# EAGLE design esp8266 (EAGLE 7.1.0)
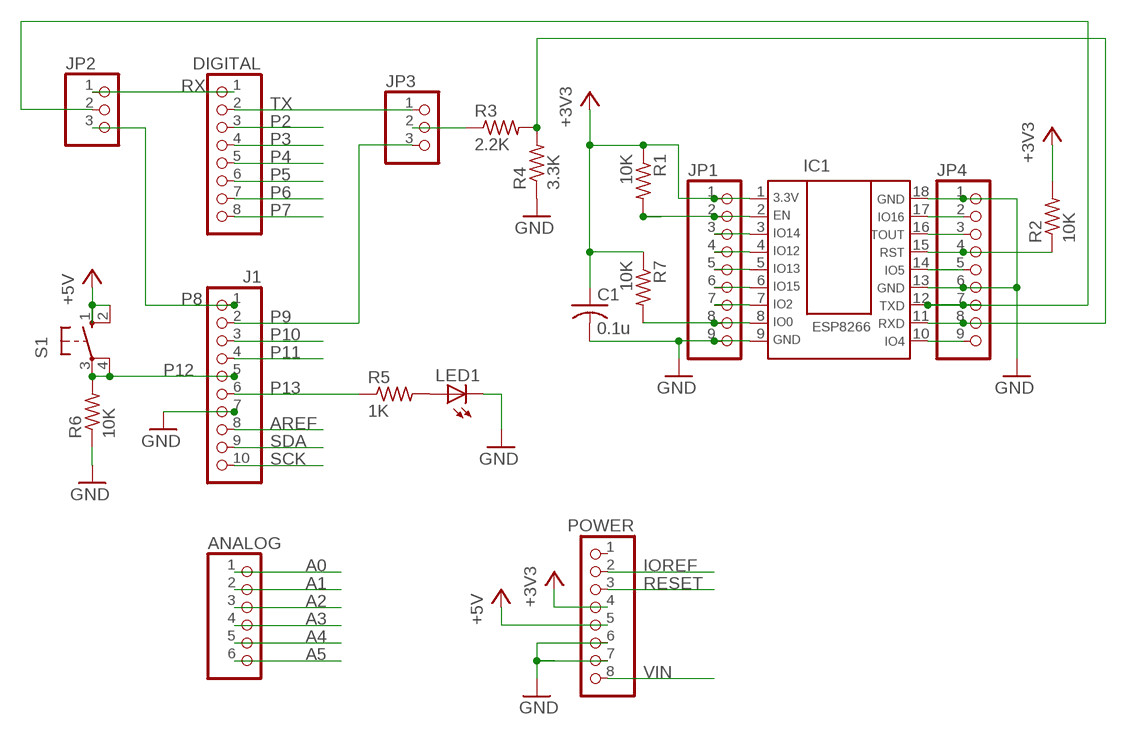
[diagram p0: schematic, sheet 1]

## Parts
ANALOG  PINHD-1X6  [1X06]
C1  0.1u  C-US050-025X075  [C050-025X075]
DIGITAL  PINHD-1X8TH  [1X08-TH]
IC1  ESP8266  [CEREVO-PKG]
J1  PINHD-1X10TH  [1X10-TH]
JP1  PINHD-1X9  [1X09]
JP2  PINHD-1X3  [1X03]
JP3  PINHD-1X3  [1X03]
JP4  PINHD-1X9  [1X09]
LED1  LED3MM  [LED3MM]
POWER  PINHD-1X8TH  [1X08-TH]
R1  10K  R-US_0207/10  [0207/10]
R2  10K  R-US_0207/10  [0207/10]
R3  2.2K  R-US_0207/10  [0207/10]
R4  3.3K  R-US_0207/10  [0207/10]
R5  1K  R-US_0207/10  [0207/10]
R6  10K  R-US_0207/10  [0207/10]
R7  10K  R-US_0207/10  [0207/10]
S1  10-XX  [B3F-10XX]

## Nets
+3V3: C1.1 IC1.1 JP1.1 POWER.4 R1.1 R2.2 R7.1
+5V: POWER.5 S1.1(S) S1.2(S1)
A0: ANALOG.1
A1: ANALOG.2
A2: ANALOG.3
A3: ANALOG.4
A4: ANALOG.5
A5: ANALOG.6
AREF: J1.8
GND: C1.2 IC1.9 IC1.13 IC1.18 J1.7 JP1.9 JP4.1 JP4.6 LED1.K(C) POWER.6 POWER.7 R4.1 R6.1
IOREF: POWER.2
N$1: IC1.11 JP4.8 R3.2 R4.2
N$2: LED1.A R5.2
N$3: JP3.2 R3.1
N$4: IC1.12 JP2.2 JP4.7
N$5: IC1.2 JP1.2 R1.2
N$6: IC1.15 JP4.4 R2.1
N$7: IC1.3 JP1.3
N$10: IC1.4 JP1.4
N$11: IC1.5 JP1.5
N$12: IC1.6 JP1.6
N$13: IC1.7 JP1.7
N$14: IC1.8 JP1.8 R7.2
N$15: IC1.10 JP4.9
N$16: IC1.17 JP4.2
N$17: IC1.16 JP4.3
N$18: IC1.14 JP4.5
P2: DIGITAL.3
P3: DIGITAL.4
P4: DIGITAL.5
P5: DIGITAL.6
P6: DIGITAL.7
P7: DIGITAL.8
P8: J1.1 JP2.3
P9: J1.2 JP3.3
P10: J1.3
P11: J1.4
P12: J1.5 R6.2 S1.3(P) S1.4(P1)
P13: J1.6 R5.1
RESET: POWER.3
RX: DIGITAL.1 JP2.1
SCK: J1.10
SDA: J1.9
TX: DIGITAL.2 JP3.1
VIN: POWER.8
Unconnected: POWER.1

## Library data of the parts
ANALOG = pinhead:PINHD-1X6: PIN HEADER
C1 = resistor:C-US: CAPACITOR, American symbol
DIGITAL POWER = SmartPrj:PINHD-1X8: PIN HEADER
IC1 = ESP8266:ESP8266: Dual In Line / Socket
J1 = SmartPrj:PINHD-1X10: PIN HEADER
JP1 JP4 = pinhead:PINHD-1X9: PIN HEADER
JP2 JP3 = pinhead:PINHD-1X3: PIN HEADER
LED1 = led:LED: LED OSRAM: - CHIPLED LG R971, LG N971, LY N971, LG Q971, LY Q971, LO R971, LY R971 LH N974, LH R974 LS Q976, LO Q976, LY Q976 LO Q996 - Hyper CHIPLED LW Q18S LB Q993, LB Q99A, LB R99A - SideLED LS A670, LO A670, LY A670, LG A670, LP A670 LB A673, LV A673, LT A673, LW A673 LH A674 LY A675 LS A676, LA A676, LO A676, LY A676, LW A676 LS A679, LY A679, LG A679 - Hyper Micro SIDELED® LS Y876, LA Y876, LO Y876, LY Y876 LT Y87S - SmartLED LW L88C, LW L88S LB L89C, LB L89S, LG L890 LS L89K, LO L89K, LY L89K LS L896, LA L896, LO L896, LY L896 - TOPLED LS T670, LO T670, LY T670, LG T670, LP T670 LSG T670, LSP T670, LSY T670, LOP T670, LYG T670 LG T671, LOG T671, LSG T671 LB T673, LV T673, LT T673, LW T673 LH T674 LS T676, LA T676, LO T676, LY T676, LB T676, LH T676, LSB T676, LW T676 LB T67C, LV T67C, LT T67C, LS T67K, LO T67K, LY T67K, LW E67C LS E67B, LA E67B, LO E67B, LY E67B, LB E67C, LV E67C, LT E67C LW T67C LS T679, LY T679, LG T679 LS T770, LO T770, LY T770, LG T770, LP T770 LB T773, LV T773, LT T773, LW T773 LH T774 LS E675, LA E675, LY E675, LS T675 LS T776, LA T776, LO T776, LY T776, LB T776 LHGB T686 LT T68C, LB T68C - Hyper Mini TOPLED® LB M676 - Mini TOPLED Santana® LG M470 LS M47K, LO M47K, LY M47K Source: http://www.osram.convergy.de LUXEON: - LUMILED® LXK2-PW12-R00, LXK2-PW12-S00, LXK2-PW14-U00, LXK2-PW14-V00 LXK2-PM12-R00, LXK2-PM12-S00, LXK2-PM14-U00 LXK2-PE12-Q00, LXK2-PE12-R00, LXK2-PE12-S00, LXK2-PE14-T00, LXK2-PE14-U00 LXK2-PB12-K00, LXK2-PB12-L00, LXK2-PB12-M00, LXK2-PB14-N00, LXK2-PB14-P00, LXK2-PB14-Q00 LXK2-PR12-L00, LXK2-PR12-M00, LXK2-PR14-Q00, LXK2-PR14-R00 LXK2-PD12-Q00, LXK2-PD12-R00, LXK2-PD12-S00 LXK2-PH12-R00, LXK2-PH12-S00 LXK2-PL12-P00, LXK2-PL12-Q00, LXK2-PL12-R00 Source: www.luxeon.com KINGBRIGHT: KA-3528ASYC Source: www.kingbright.com
R1-R7 = resistor:R-US_: RESISTOR, American symbol
S1 = switch-omron:10-XX: OMRON SWITCH; MPN: B3F-1000; OC_FARNELL: 176432; OC_NEWARK: 36M3542

## Board
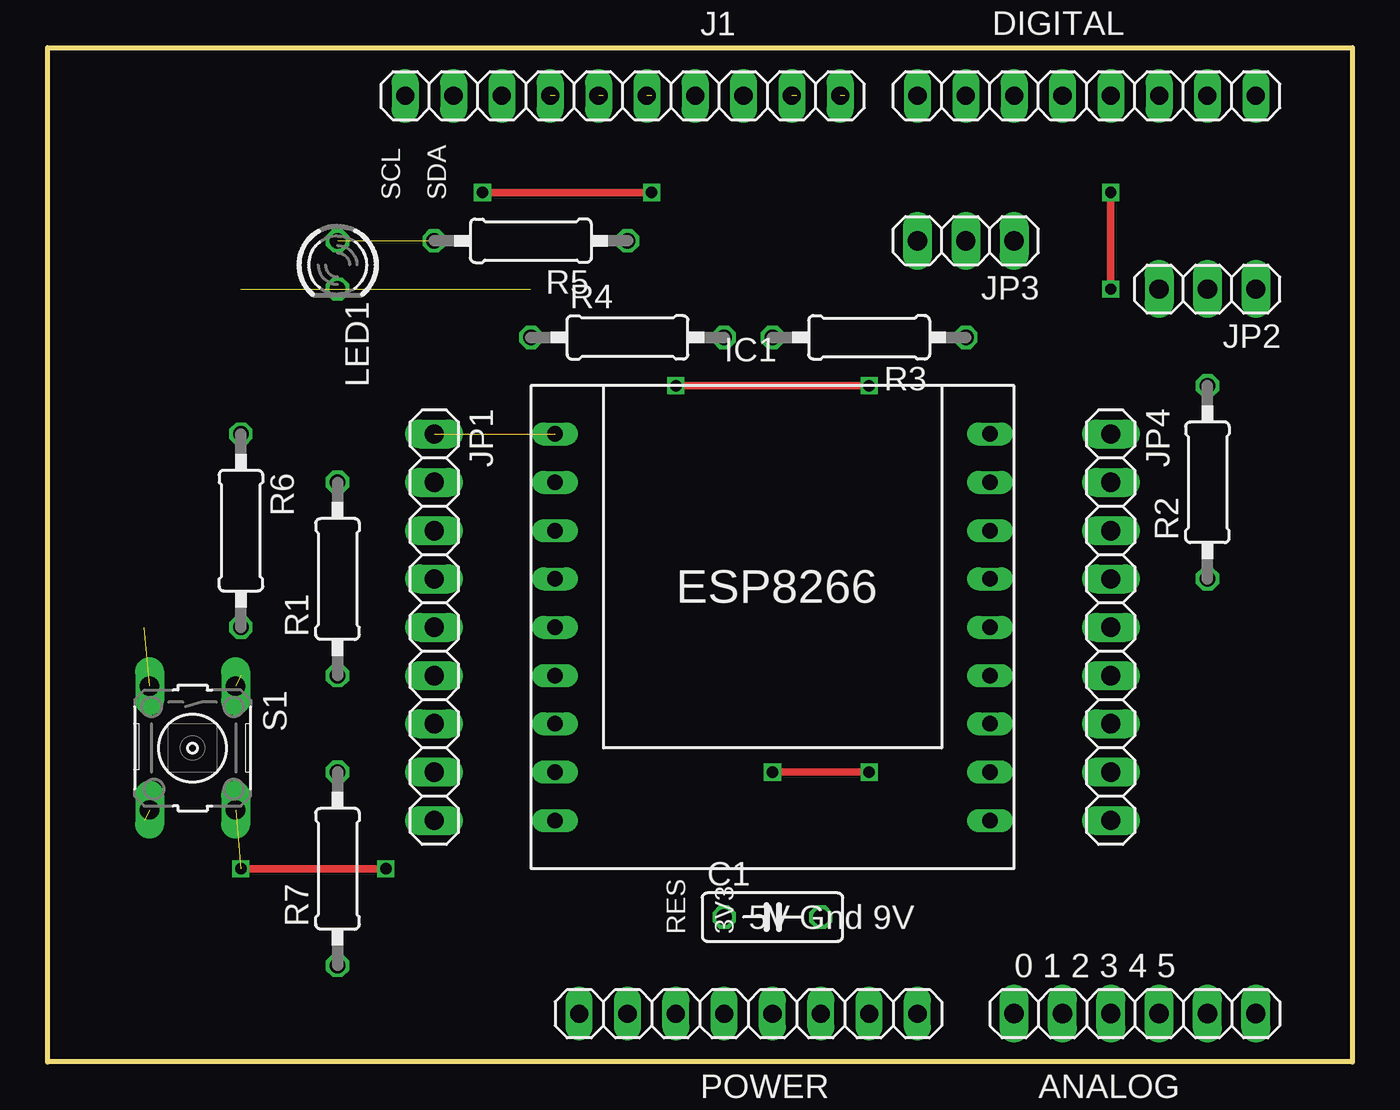
[diagram p1: board, top side]
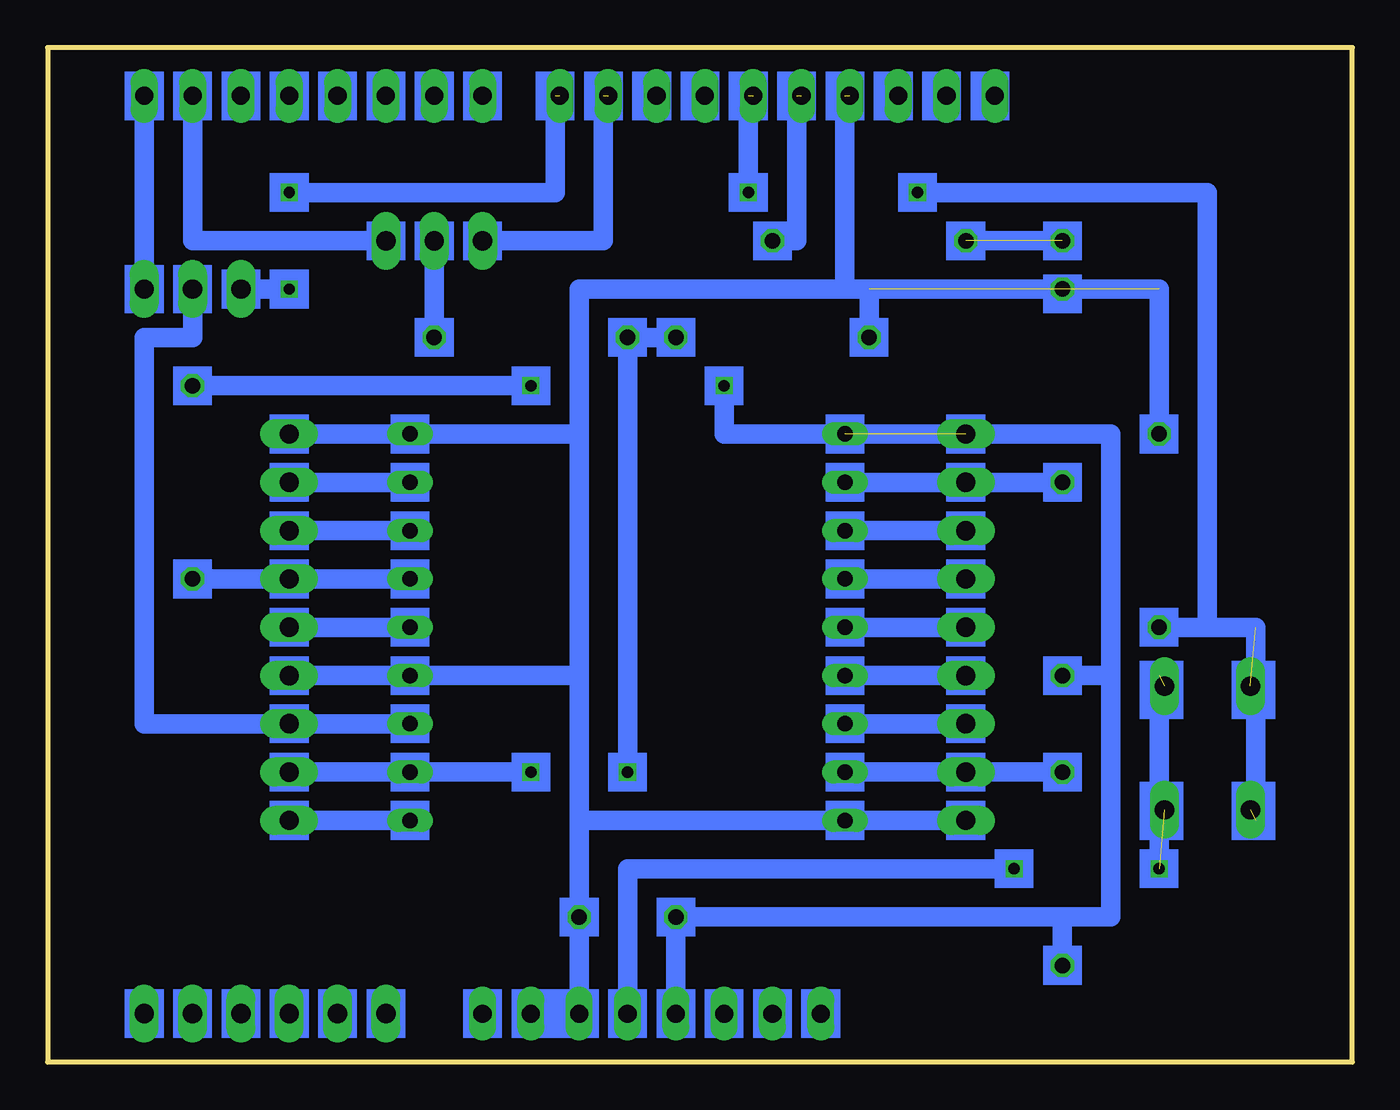
[diagram p2: board, bottom side, seen from below]

Size 68.58 x 53.34 mm. Coordinates in mm from the lower left corner, seen from the top.
Outline: 0,0 0,53.34 68.58,53.34 68.58,0 0,0
Copper layers (1*16): Top 0.035mm / dielectric 1.53mm / Bottom 0.035mm
Design rules "pban_4mil-l2": minimum track width 0.1mm, minimum drill 0.3mm, track to track 0.1mm, track to pad 0.229mm, pad to pad 0.1mm, via to via 0.1mm, smd to smd 0.1mm, copper to edge 0.5mm, drill to drill 0.5mm, minimum pad ring 0.15mm, minimum via ring 0.15mm, stop-mask expansion 4mil, vias tented up to drill 0.35mm, thermal gap 10mil

### Footprints (pad centres in the part's own frame; a part is rotated, then mirrored left to right if it is on the bottom)
1X06 = drill 1.016 long: 1 -6.35,0; 2 -3.81,0; 3 -1.27,0; 4 1.27,0; 5 3.81,0; 6 6.35,0
C050-025X075 = drill 0.813 octagon: 1 -2.54,0; 2 2.54,0
1X08-TH = drill 0.95 pad 1.422 long: 1 -8.89,0; 2 -6.35,0; 3 -3.81,0; 4 -1.27,0; 5 1.27,0; 6 3.81,0; 7 6.35,0; 8 8.89,0
CEREVO-PKG = drill 0.813 long: 1 -11.43,10.16; 2 -11.43,7.62; 3 -11.43,5.08; 4 -11.43,2.54; 5 -11.43,0; 6 -11.43,-2.54; 7 -11.43,-5.08; 8 -11.43,-7.62; 9 -11.43,-10.16; 10 11.43,-10.16; 11 11.43,-7.62; 12 11.43,-5.08; 13 11.43,-2.54; 14 11.43,0; 15 11.43,2.54; 16 11.43,5.08; 17 11.43,7.62; 18 11.43,10.16
1X10-TH = drill 0.95 pad 1.422 long: 1 -11.43,0; 2 -8.89,0; 3 -6.35,0; 4 -3.81,0; 5 -1.27,0; 6 1.27,0; 7 3.81,0; 8 6.35,0; 9 8.89,0; 10 11.43,0
1X09 = drill 1.016 long: 1 -10.16,0; 2 -7.62,0; 3 -5.08,0; 4 -2.54,0; 5 0,0; 6 2.54,0; 7 5.08,0; 8 7.62,0; 9 10.16,0
1X03 = drill 1.016 long: 1 -2.54,0; 2 0,0; 3 2.54,0
LED3MM = drill 0.813 octagon: A -1.27,0; K 1.27,0
0207/10 = drill 0.813 octagon: 1 -5.08,0; 2 5.08,0
B3F-10XX = drill 1.016 long: 1 -3.251,2.261; 2 3.251,2.261; 3 -3.251,-2.261; 4 3.251,-2.261

### Placement (x,y rotation side)
ANALOG  57.15,2.54 0 top
C1  38.1,7.62 0 top
DIGITAL  54.61,50.8 180 top
IC1  38.1,22.86 0 top
J1  30.23,50.8 180 top
JP1  20.32,22.86 270 top
JP2  60.96,40.64 180 top
JP3  48.26,43.18 180 top
JP4  55.88,22.86 270 top
LED1  15.24,41.91 270 top
POWER  36.83,2.54 0 top
R1  15.24,25.4 90 top
R2  60.96,30.48 90 top
R3  43.18,38.1 180 top
R4  30.48,38.1 0 top
R5  25.4,43.18 180 top
R6  10.16,27.94 270 top
R7  15.24,10.16 90 top
S1  7.62,16.51 270 top

### Tracks (layer width: path | path; a pad name or v marks a point on that pad's centre or on a via)
+3V3  (via drill 0.6)  (1 unrouted)
  Top 0.406: v33.02,35.56 v43.18,35.56
  Bottom 1.016: POWER.4 C1.1 15.24,7.62 | 15.24,7.62 12.7,7.62 12.7,20.32 | v43.18,35.56 R2.2 | R1.1 12.7,20.32 | 12.7,20.32 12.7,33.02 JP1.1 33.02,33.02 v33.02,35.56 | 15.24,7.62 R7.1
+5V  (via drill 0.6)  (2 unrouted)
  Top 0.406: v17.78,10.16 v10.16,10.16
  Bottom 1.016: POWER.5 38.1,10.16 v17.78,10.16 | v10.16,10.16 10.16,20.32
GND  (3 unrouted)
  Bottom 1.016: 26.67,50.8 26.67,40.64 | POWER.7 POWER.6 C1.2 40.64,12.7 | JP1.9 IC1.9 40.64,12.7 | JP4.6 IC1.13 40.64,20.32 | JP4.1 IC1.18 40.64,33.02 | 40.64,20.32 40.64,12.7 | 40.64,33.02 40.64,20.32 | 40.64,33.02 40.64,40.64 26.67,40.64 | 26.67,40.64 25.4,40.64 | R6.1 10.16,40.64 25.4,40.64 | R4.1 25.4,40.64
N$1  (via drill 0.6)
  Top 0.406: v43.18,15.24 v38.1,15.24
  Bottom 1.016: JP4.8 IC1.11 v43.18,15.24 | R4.2 R3.2 v38.1,15.24
N$2  (1 unrouted)
  Bottom 1.016: R5.2 LED1.A
N$3
  Bottom 1.016: JP3.2 R3.1
N$4
  Bottom 1.016: IC1.12 JP4.7 63.5,17.78 63.5,38.1 60.96,38.1 JP2.2
N$5
  Bottom 1.016: IC1.2 JP1.2 R1.2
N$6
  Bottom 1.016: IC1.15 JP4.4 R2.1
N$7
  Bottom 1.016: JP1.3 IC1.3
N$10
  Bottom 1.016: JP1.4 IC1.4
N$11
  Bottom 1.016: JP1.5 IC1.5
N$12
  Bottom 1.016: JP1.6 IC1.6
N$13
  Bottom 1.016: JP1.7 IC1.7
N$14
  Bottom 1.016: IC1.8 JP1.8 R7.2
N$15
  Bottom 1.016: IC1.10 JP4.9
N$16
  Bottom 1.016: IC1.17 JP4.2
N$17
  Bottom 1.016: IC1.16 JP4.3
N$18
  Bottom 1.016: IC1.14 JP4.5
P8  (via drill 0.6)  (1 unrouted)
  Top 0.406: v55.88,45.72 v55.88,40.64
  Bottom 1.016: 41.91,50.8 41.91,45.72 v55.88,45.72 | v55.88,40.64 JP2.3
P9  (1 unrouted)
  Bottom 1.016: 39.37,50.8 39.37,43.18 JP3.3
P12  (via drill 0.6)  (3 unrouted)
  Top 0.406: v31.75,45.72 v22.86,45.72
  Bottom 1.016: 31.75,50.8 v31.75,45.72 | v22.86,45.72 7.62,45.72 7.62,22.86 | 5.08,12.7 5.08,22.86 7.62,22.86 | R6.2 7.62,22.86
P13  (1 unrouted)
  Bottom 1.016: 29.21,50.8 29.21,43.18 R5.1
RX
  Bottom 1.016: DIGITAL.1 JP2.1
TX
  Bottom 1.016: DIGITAL.2 60.96,43.18 JP3.1
(copper drawn outside any net)
  shapes: Bottom area x107

### Text on the board
tNames: SCL | SDA | RES | 3V3 | 5V Gnd 9V | 0 1 2 3 4 5
bStop: 7 | 6 | 5 | 4 | 3 | 2 | 1 | 0 | 12 | 10 | SCL | SDA | AREF | GND | 9 | 8 | IOREF | RST | 3.3V | GND | GND | VIN | 0 | 1 | 2 | 3 | 4 | 5 | 5V